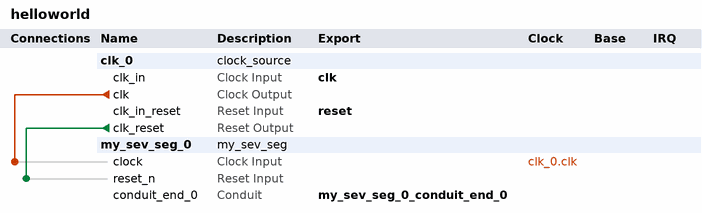
[diagram p0: system contents]
# Platform Designer (Qsys) system helloworld, Cyclone II EP2C35F672C6
# Parameters at their usual value, and those the tool derives, are not listed.
package require -exact qsys 12.1
create_system helloworld
set_project_property DEVICE_FAMILY {Cyclone II}
set_project_property DEVICE EP2C35F672C6

add_instance clk_0 clock_source 12.1
set_instance_parameter_value clk_0 clockFrequency 50000000

add_instance my_sev_seg_0 my_sev_seg 1.0

# connections
add_connection clk_0.clk my_sev_seg_0.clock clock
add_connection clk_0.clk_reset my_sev_seg_0.reset_n reset

# exported interfaces
add_interface clk clock sink
set_interface_property clk EXPORT_OF clk_0.clk_in
add_interface reset reset sink
set_interface_property reset EXPORT_OF clk_0.clk_in_reset
add_interface my_sev_seg_0_conduit_end_0 conduit end
set_interface_property my_sev_seg_0_conduit_end_0 EXPORT_OF my_sev_seg_0.conduit_end_0

save_system helloworld.qsys
